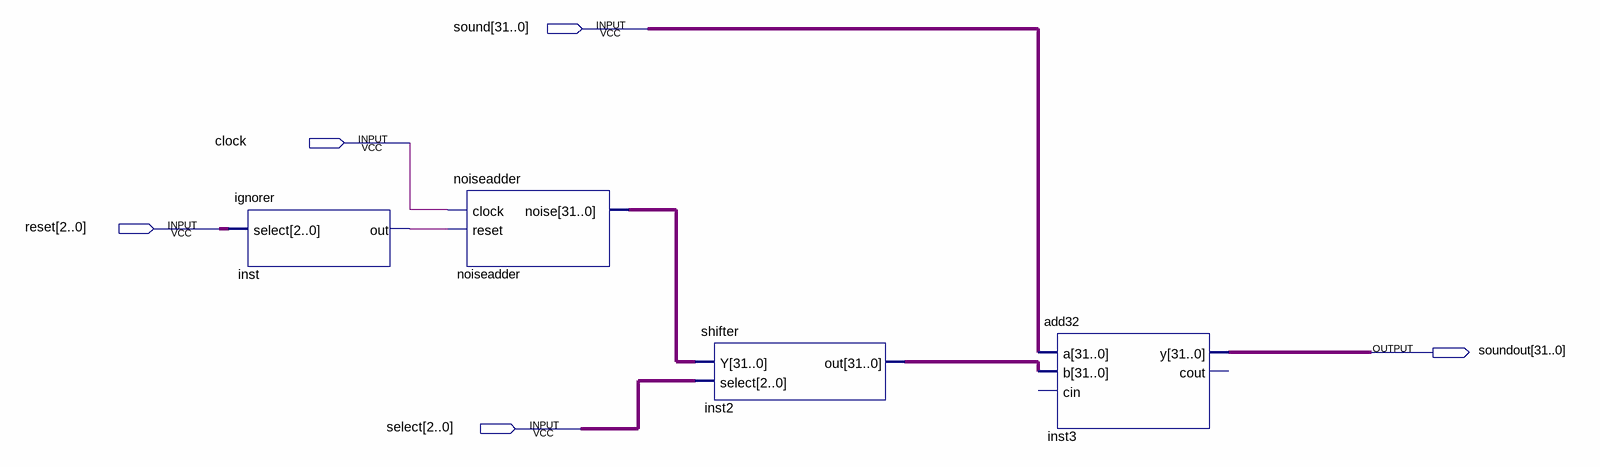
[diagram p0: schematic sheet]
// Quartus schematic add_noise_to_audio.bdf as structural Verilog: 4 symbols, 5 pins
module add_noise_to_audio (
  input  [31:0] sound,
  input  clock,
  input  [2:0] reset,
  input  [2:0] select,
  output [31:0] soundout
);

  wire inst_out;
  wire [31:0] inst2_out, noiseadder_noise;

  ignorer inst (.select(reset), .out(inst_out));
  noiseadder noiseadder (.clock(clock), .reset(inst_out), .noise(noiseadder_noise));
  shifter inst2 (.Y(noiseadder_noise), .select(select), .out(inst2_out));
  add32 inst3 (.a(sound), .b(inst2_out), .y(soundout));  // open: cin, cout
endmodule
